# Altium schematic sheet Schematic.SchDoc
size A4
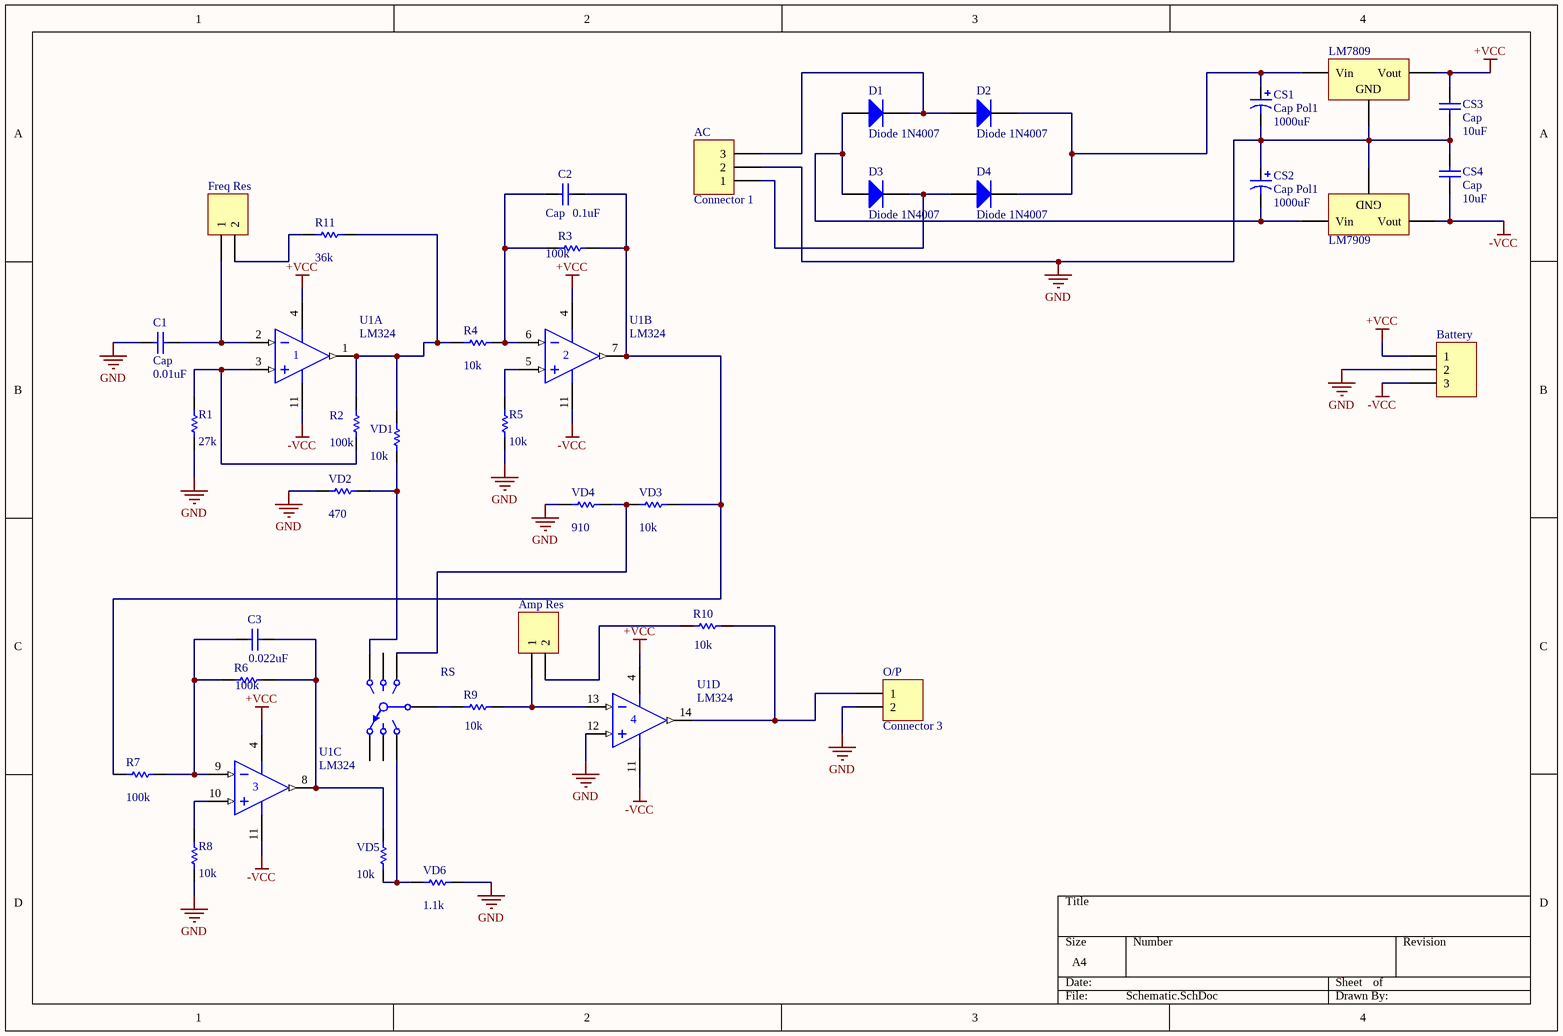
[diagram p0: Schematic.SchDoc]

## Parts
AC  Connector 1  [HDR1X3H]
Amp_Res  (no value)  [HDR1X2]
Battery  (no value)  [HDR1X3H]
C1  Cap  value 0.01uF  [RAD-0.1]
C2  Cap  value 0.1uF  [RAD-0.1]
C3  value 0.022uF  [RAD-0.1]
CS1  Cap Pol1  value 1000uF  [RB5-10.5]
CS2  Cap Pol1  value 1000uF  [RB5-10.5]
CS3  Cap  value 10uF  [RAD-0.1]
CS4  Cap  value 10uF  [RAD-0.1]
D1  Diode 1N4007  [DO-41]
D2  Diode 1N4007  [DO-41]
D3  Diode 1N4007  [DO-41]
D4  Diode 1N4007  [DO-41]
Freq_Res  (no value)  [HDR1X2]
LM7809  (no value)  [TO-262-AA]
LM7909  (no value)  [TO-262-AA]
O/P  Connector 3  [HDR1X2]
R1  value 27k  [AXIAL-0.4]
R2  value 100k  [AXIAL-0.4]
R3  value 100k  [AXIAL-0.4]
R4  value 10k  [AXIAL-0.4]
R5  value 10k  [AXIAL-0.4]
R6  value 100k  [AXIAL-0.4]
R7  value 100k  [AXIAL-0.4]
R8  value 10k  [AXIAL-0.4]
R9  value 10k  [AXIAL-0.4]
R10  value 10k  [AXIAL-0.4]
R11  value 36k  [AXIAL-0.4]
RS  (no value)  [SW-7]
U1  LM324  [646-06]  (parts A,B,C,D of 4)
VD1  value 10k  [AXIAL-0.4]
VD2  value 470  [AXIAL-0.4]
VD3  value 10k  [AXIAL-0.4]
VD4  value 910  [AXIAL-0.4]
VD5  value 10k  [AXIAL-0.4]
VD6  value 1.1k  [AXIAL-0.4]

## Nets
+VCC: Battery.1 CS3.2 LM7809.3(Vout) U1.4(V+)
-VCC: Battery.3 CS4.1 LM7909.3(Vout) U1.11(V-)
GND: AC.2 Battery.2 C1.2 CS1.2 CS2.1 CS3.1 CS4.2 LM7809.2(GND) LM7909.2(GND) O/P.2 R1.2 R5.1 R8.2 U1.12(IN+) VD2.1 VD4.1 VD6.2
NetAC_1: AC.1 D3.2(K) D4.1(A)
NetAC_3: AC.3 D1.2(K) D2.1(A)
NetAmp_Res_1: Amp_Res.1 R9.2 U1.13(IN-)
NetAmp_Res_2: Amp_Res.2 R10.1
NetC1_1: C1.1 Freq_Res.1 U1.2(IN-)
NetC2_1: C2.1 R3.2 R7.1 U1.7(OUT) VD3.2
NetC2_2: C2.2 R3.1 R4.1 U1.6(IN-)
NetC3_1: C3.1 R6.2 U1.8(OUT) VD5.1
NetC3_2: C3.2 R6.1 R7.2 U1.9(IN-)
NetCS1_1: CS1.1 D2.2(K) D4.2(K) LM7809.1(Vin)
NetCS2_2: CS2.2 D1.1(A) D3.1(A) LM7909.1(Vin)
NetFreq_Res_2: Freq_Res.2 R11.1
NetO/P_1: O/P.1 R10.2 U1.14(OUT)
NetR1_1: R1.1 R2.2 U1.3(IN+)
NetR2_1: R2.1 R4.2 R11.2 U1.1(OUT) VD1.1
NetR5_2: R5.2 U1.5(IN+)
NetR8_1: R8.1 U1.10(IN+)
NetR9_1: R9.1 RS.7
NetRS_1: RS.1 VD3.1 VD4.2
NetRS_3: RS.3 VD1.2 VD2.2
NetRS_4: RS.4 VD5.2 VD6.1

Not connected (* = marked no-connect by the designer): RS 2 5 6

## Library data of the parts
AC Battery = Header 3H: Header, 3-Pin, Right Angle; LatestRevisionDate: 17-Jul-2002; LatestRevisionNote: Re-released for DXP Platform.; Publisher: Altium Limited
Amp_Res Freq_Res O/P = Header 2: Header, 2-Pin; LatestRevisionDate: 17-Jul-2002; LatestRevisionNote: Re-released for DXP Platform.; Publisher: Altium Limited
C1-C3 CS3 CS4 = Cap: Capacitor; Published: 8-Jun-2000; LatestRevisionDate: 17-Jul-2002; LatestRevisionNote: Re-released for DXP Platform.; PackageReference: RAD-0.3; Publisher: Altium Limited; PackageDescription: Radial Cap, Thru-Hole; 2 Leads; 0.3 in Pin Spacing
CS1 CS2 = Cap Pol1: Polarized Capacitor (Radial); Published: 8-Jun-2000; LatestRevisionDate: 17-Jul-2002; LatestRevisionNote: Re-released for DXP Platform.; PackageReference: RB7.6-15; Publisher: Altium Limited; PackageDescription: Polarized Capacitor (Radial); 2 Leads
D1-D4 = Diode 1N4007: 1 Amp General Purpose Rectifier; Published: 8-Jun-2000; LatestRevisionDate: 17-Jul-2002; LatestRevisionNote: Re-released for DXP Platform.; DatasheetVersion: 1998; PackageVersion: Aug-1999; PackageReference: DO-41; Publisher: Altium Limited; PackageDescription: Diode, Axial; Body 5.2 x 2.7 mm (LxDia. max), Lead Dia. 0.86 mm (max); Code_JEDEC: DO-204-AL; ComponentLink1Description: Manufacturer Link; ComponentLink1URL: http://www.fairchildsemi.com/; ComponentLink2Description: Datasheet; ComponentLink2URL: http://www.fairchildsemi.com/ds/1N%2F1N4001.pdf
LM7809 LM7909 = Volt Reg: Voltage Regulator; Published: 24-Mar-1999; LatestRevisionDate: 29-May-2009; LatestRevisionNote: IPC-7351 Footprint Added.; PackageReference: D2PAK; Publisher: Altium Limited; PackageDescription: 3-Pin Transistor Outline Package 2.54 mm Pitch, 15.1 mm Lead Span
R1-R11 VD1-VD6 = Res1: Resistor; Published: 8-Jun-2000; LatestRevisionDate: 17-Jul-2002; LatestRevisionNote: Re-released for DXP Platform.; PackageReference: AXIAL-0.3; Publisher: Altium Limited; PackageDescription: Axial Device, Thru-Hole; 2 Leads; 0.3 in Pin Spacing
RS = SW-6WAY: 6 Way Switch; Published: 24-Mar-1999; LatestRevisionDate: 17-Jul-2002; LatestRevisionNote: Re-released for DXP Platform.; PackageReference: SW-7; Publisher: Altium Limited; PackageDescription: Switch; 7 Leads
U1 = MC34074VP: Single-Supply 3 to 44 V Operational Amplifier; Published: 28-Feb-2003; DatasheetVersion: Jan-2002, Rev. 5; PackageVersion: 1995; PackageReference: 646-06; Publisher: Altium Limited; PackageDescription: DIP; 14 Leads; Row Spacing 7.62 mm; Pitch 2.54 mm; ComponentLink1Description: Manufacturer Link; ComponentLink1URL: http://www.onsemi.com/; ComponentLink2Description: Datasheet; ComponentLink2URL: http://www.onsemi.com/pub/Collateral/MC34071-D.PDF